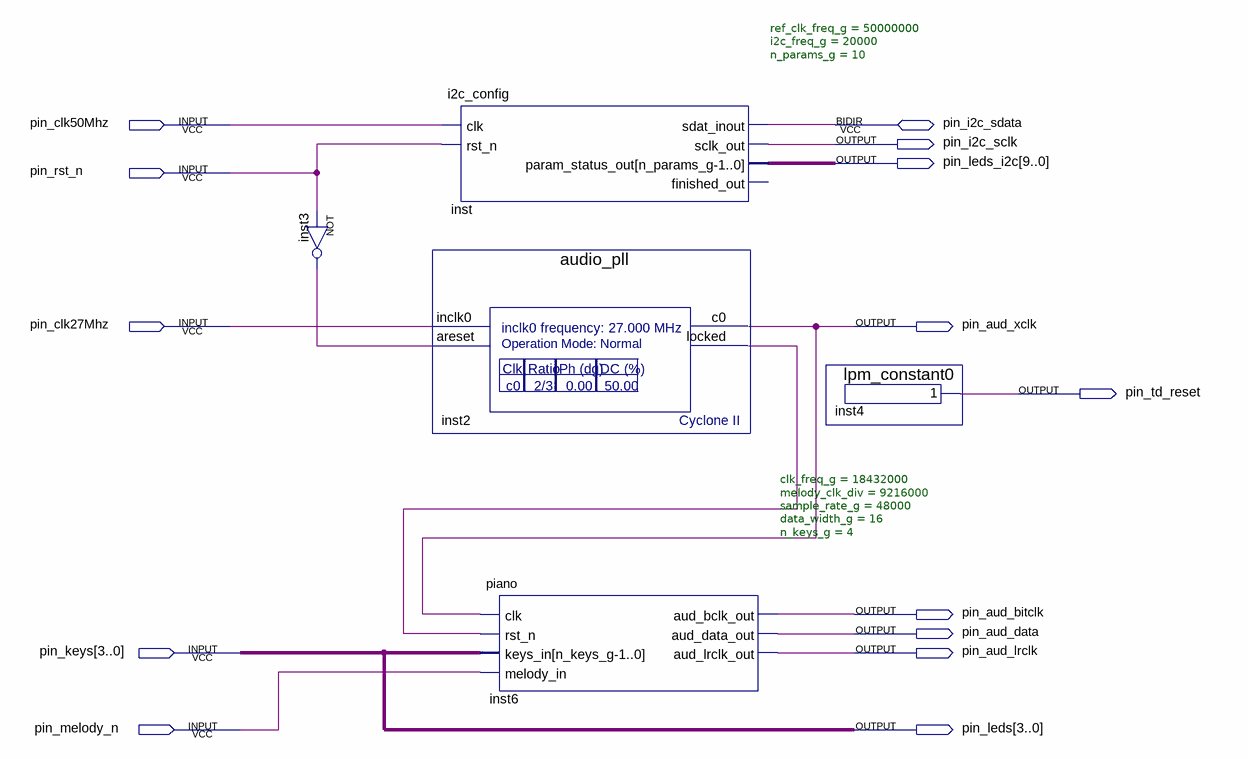
[diagram p0: schematic sheet]
// Quartus schematic system_top_level.bdf as structural Verilog: 5 symbols, 14 pins
module system_top_level (
  input  pin_clk50Mhz,
  input  pin_rst_n,
  input  pin_clk27Mhz,
  input  [3:0] pin_keys,
  input  pin_melody_n,
  inout  pin_i2c_sdata,
  output pin_i2c_sclk,
  output [9:0] pin_leds_i2c,
  output pin_aud_xclk,
  output pin_td_reset,
  output pin_aud_bitclk,
  output pin_aud_data,
  output pin_aud_lrclk,
  output [3:0] pin_leds
);

  wire inst2_locked, inst3_out;

  not inst3 (inst3_out, pin_rst_n);
  i2c_config #(.ref_clk_freq_g(50000000), .i2c_freq_g(20000), .n_params_g(10)) inst (
    .clk(pin_clk50Mhz), .rst_n(pin_rst_n), .sclk_out(pin_i2c_sclk), .param_status_out(pin_leds_i2c),
    .sdat_inout(pin_i2c_sdata));  // open: finished_out
  audio_pll inst2 (.inclk0(pin_clk27Mhz), .areset(inst3_out), .c0(pin_aud_xclk), .locked(inst2_locked));
  piano #(.clk_freq_g(18432000), .melody_clk_div(9216000), .sample_rate_g(48000), .data_width_g(16), .n_keys_g(4)) inst6 (
    .clk(pin_aud_xclk), .rst_n(inst2_locked), .keys_in(pin_keys), .melody_in(pin_melody_n),
    .aud_bclk_out(pin_aud_bitclk), .aud_data_out(pin_aud_data), .aud_lrclk_out(pin_aud_lrclk));
  lpm_constant0 inst4 (.result(pin_td_reset));

  assign pin_leds = pin_keys;
endmodule
